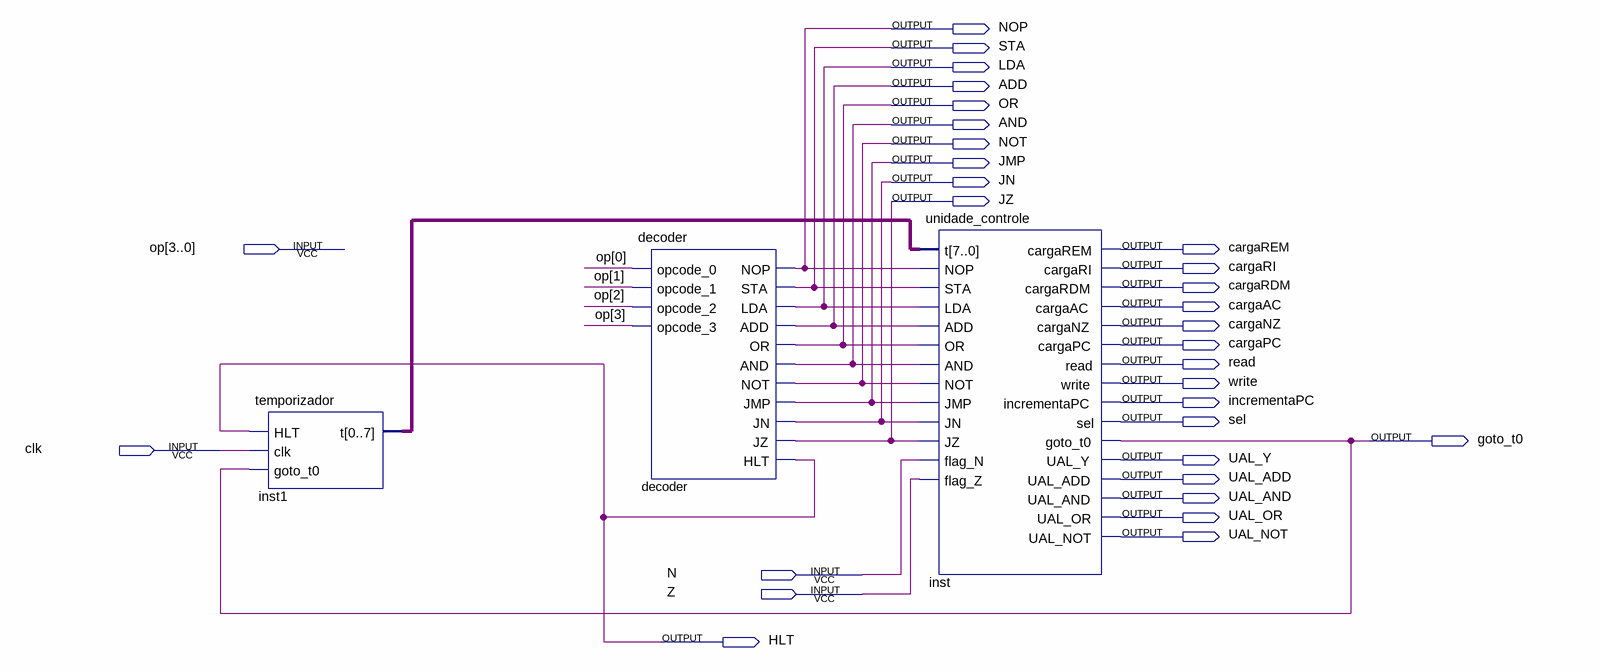
[diagram p0: schematic sheet]
// Quartus schematic complete.bdf as structural Verilog: 3 symbols, 31 pins
module complete (
  input  [3:0] op,
  input  clk,
  input  N,
  input  Z,
  output NOP,
  output STA,
  output LDA,
  output ADD,
  output OR,
  output AND,
  output NOT,
  output JMP,
  output JN,
  output JZ,
  output cargaREM,
  output cargaRI,
  output cargaRDM,
  output cargaAC,
  output cargaNZ,
  output cargaPC,
  output read,
  output write,
  output incrementaPC,
  output sel,
  output goto_t0,
  output UAL_Y,
  output UAL_ADD,
  output UAL_AND,
  output UAL_OR,
  output UAL_NOT,
  output HLT
);

  wire [7:0] inst1_t;

  temporizador inst1 (.HLT(HLT), .clk(clk), .goto_t0(goto_t0), .t(inst1_t));
  decoder decoder (
    .opcode_0(op[0]), .opcode_1(op[1]), .opcode_2(op[2]), .opcode_3(op[3]), .NOP(NOP), .STA(STA), .LDA(LDA),
    .ADD(ADD), .OR(OR), .AND(AND), .NOT(NOT), .JMP(JMP), .JN(JN), .JZ(JZ), .HLT(HLT));
  unidade_controle inst (
    .t(inst1_t), .NOP(NOP), .STA(STA), .LDA(LDA), .ADD(ADD), .OR(OR), .AND(AND), .NOT(NOT), .JMP(JMP),
    .JN(JN), .JZ(JZ), .flag_N(N), .flag_Z(Z), .cargaREM(cargaREM), .cargaRI(cargaRI), .cargaRDM(cargaRDM),
    .cargaAC(cargaAC), .cargaNZ(cargaNZ), .cargaPC(cargaPC), .read(read), .write(write),
    .incrementaPC(incrementaPC), .sel(sel), .goto_t0(goto_t0), .UAL_Y(UAL_Y), .UAL_ADD(UAL_ADD),
    .UAL_AND(UAL_AND), .UAL_OR(UAL_OR), .UAL_NOT(UAL_NOT));
endmodule
